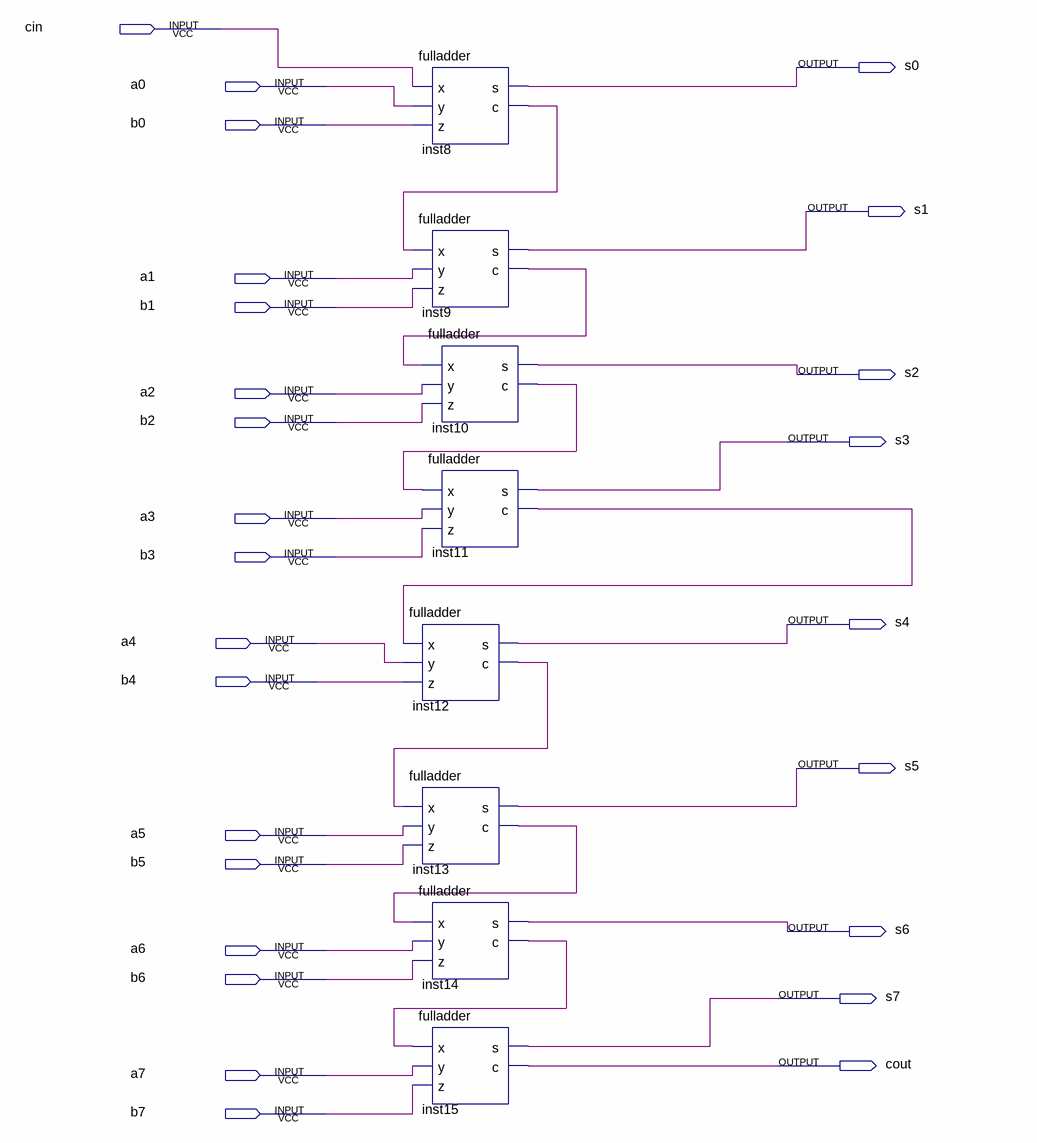
[diagram p0: schematic sheet]
// Quartus schematic eightbitadder.bdf as structural Verilog: 8 symbols, 26 pins
module eightbitadder (
  input  cin,
  input  a0,
  input  b0,
  input  a1,
  input  b1,
  input  a2,
  input  b2,
  input  a3,
  input  b3,
  input  a4,
  input  b4,
  input  a5,
  input  b5,
  input  a6,
  input  b6,
  input  a7,
  input  b7,
  output s0,
  output s1,
  output s2,
  output s3,
  output s4,
  output s5,
  output s6,
  output s7,
  output cout
);

  wire inst8_c, inst9_c, inst10_c, inst11_c, inst12_c, inst13_c, inst14_c;

  fulladder inst8 (.x(cin), .y(a0), .z(b0), .s(s0), .c(inst8_c));
  fulladder inst9 (.x(inst8_c), .y(a1), .z(b1), .s(s1), .c(inst9_c));
  fulladder inst10 (.x(inst9_c), .y(a2), .z(b2), .s(s2), .c(inst10_c));
  fulladder inst11 (.x(inst10_c), .y(a3), .z(b3), .s(s3), .c(inst11_c));
  fulladder inst12 (.x(inst11_c), .y(a4), .z(b4), .s(s4), .c(inst12_c));
  fulladder inst13 (.x(inst12_c), .y(a5), .z(b5), .s(s5), .c(inst13_c));
  fulladder inst14 (.x(inst13_c), .y(a6), .z(b6), .s(s6), .c(inst14_c));
  fulladder inst15 (.x(inst14_c), .y(a7), .z(b7), .s(s7), .c(cout));
endmodule
